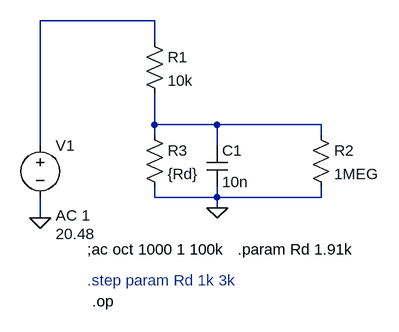
[diagram p0: schematic AN_MONITOR_antialiasing_RC.asc]
AN_MONITOR_antialiasing_RC.asc, the LTspice schematic file:
Version 4
SHEET 1 880 680
WIRE 160 -80 -16 -80
WIRE 160 -48 160 -80
WIRE 160 80 160 32
WIRE 256 80 160 80
WIRE 416 80 256 80
WIRE 160 96 160 80
WIRE 416 96 416 80
WIRE -16 112 -16 -80
WIRE 256 112 256 80
WIRE 160 192 160 176
WIRE 256 192 256 176
WIRE 256 192 160 192
WIRE 416 192 416 176
WIRE 416 192 256 192
WIRE 256 208 256 192
WIRE -16 224 -16 192
FLAG 256 208 0
FLAG -16 224 0
SYMBOL cap 240 112 R0
SYMATTR InstName C1
SYMATTR Value 10n
SYMBOL res 400 80 R0
SYMATTR InstName R2
SYMATTR Value 1MEG
SYMBOL voltage -16 96 R0
WINDOW 123 24 124 Left 2
WINDOW 39 0 0 Left 2
WINDOW 3 24 152 Left 2
SYMATTR Value2 AC 1
SYMATTR Value 20.48
SYMATTR InstName V1
SYMBOL res 144 -64 R0
SYMATTR InstName R1
SYMATTR Value 10k
SYMBOL res 144 80 R0
SYMATTR InstName R3
SYMATTR Value {Rd}
TEXT 56 272 Left 2 !;ac oct 1000 1 100k
TEXT 56 320 Left 2 ;.step param Rd 1k 3k
TEXT 288 272 Left 2 !.param Rd 1.91k
TEXT 64 352 Left 2 !.op

The netlist it stands for:
* AN_MONITOR_antialiasing_RC.asc
C1 N002 0 10n
R2 N002 0 1MEG
V1 N001 0 20.48 AC 1
R1 N001 N002 10k
R3 N002 0 {Rd}
;ac oct 1000 1 100k
* .step param Rd 1k 3k
.param Rd 1.91k
.op
.backanno
.end